# EAGLE design ScreamFilter (EAGLE 6.6.0)
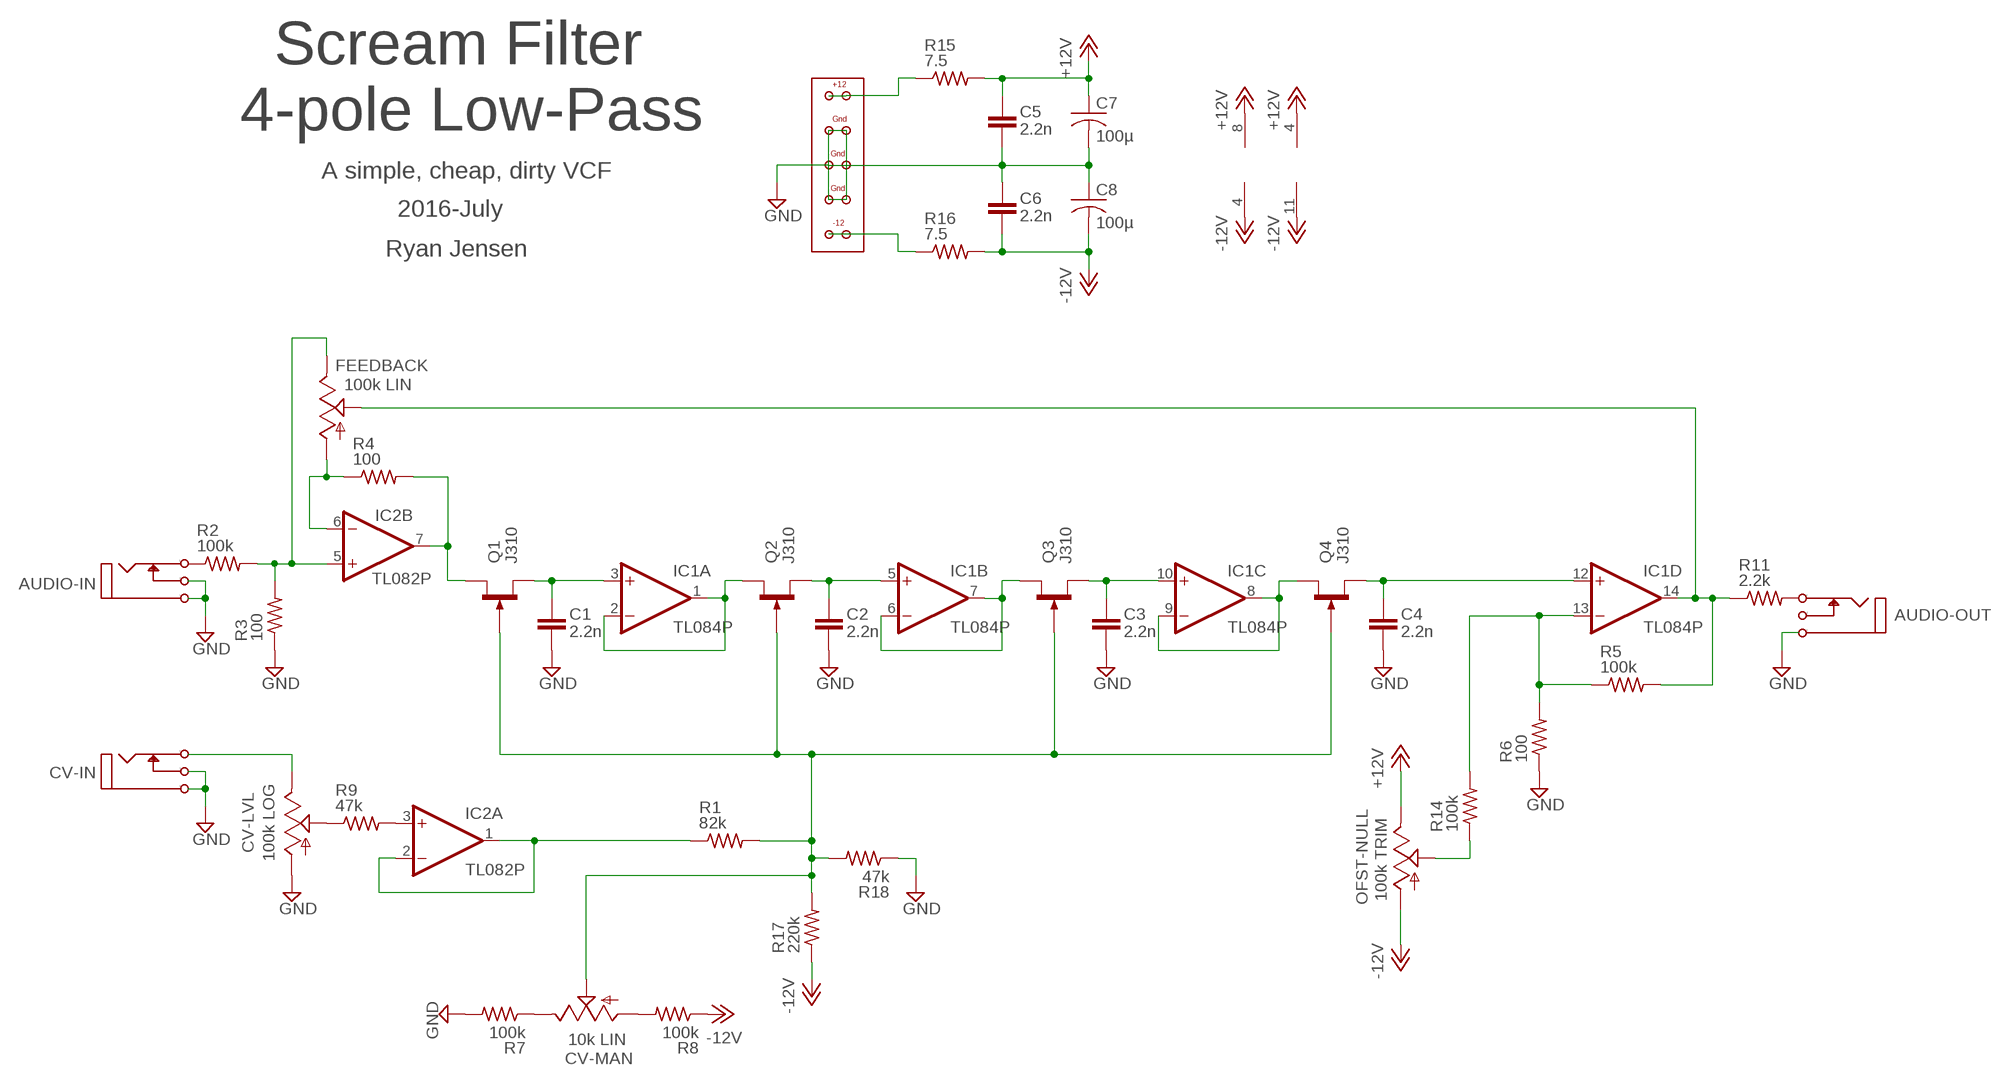
[diagram p0: schematic, sheet 1]

## Parts
AUDIO-IN  I/O  MONO_JACK  [MONO_JACK]
AUDIO-OUT  I/O  MONO_JACK  [MONO_JACK]
C1  2.2n  C-EU025-025X050  [C025-025X050]
C2  2.2n  C-EU025-025X050  [C025-025X050]
C3  2.2n  C-EU025-025X050  [C025-025X050]
C4  2.2n  C-EU025-025X050  [C025-025X050]
C5  2.2n  C-EU025-025X050  [C025-025X050]
C6  2.2n  C-EU025-025X050  [C025-025X050]
C7  100µ  C-US025-050X050  [C025-050X050]
C8  100µ  C-US025-050X050  [C025-050X050]
CV-IN  I/O  MONO_JACK  [MONO_JACK]
CV-LVL  100k LOG  TRIM_US-B64Y  [B64Y]
CV-MAN  10k LIN  TRIM_US-B64Y  [B64Y]
FEEDBACK  100k LIN  TRIM_US-B64Y  [B64Y]
IC1  TL084P  [DIL14]
IC2  TL082P  [DIL08]
OFST-NULL  100k TRIM  TRIM_US-B64Y  [B64Y]
Q1  J310  [TO92R]
Q2  J310  [TO92R]
Q3  J310  [TO92R]
Q4  J310  [TO92R]
R1  82k  R-US_0204/7  [0204/7]
R2  100k  R-US_0204/7  [0204/7]
R3  100  R-US_0204/7  [0204/7]
R4  100  R-US_0204/7  [0204/7]
R5  100k  R-US_0204/7  [0204/7]
R6  100  R-US_0204/7  [0204/7]
R7  100k  R-US_0204/7  [0204/7]
R8  100k  R-US_0204/7  [0204/7]
R9  47k  R-US_0204/7  [0204/7]
R11  2.2k  R-US_0204/7  [0204/7]
R14  100k  R-US_0204/7  [0204/7]
R15  7.5  R-US_0204/7  [0204/7]
R16  7.5  R-US_0204/7  [0204/7]
R17  220k  R-US_0204/7  [0204/7]
R18  47k  R-US_0204/7  [0204/7]
U$1  EURORACK-POWER  [EURORACK-POWER]

## Nets
+12V: C5.1 C7.1 IC1.4(P:V+) IC2.8(P:V+) OFST-NULL.E R15.2
-12V: C6.2 C8.2 IC1.11(P:V-) IC2.4(P:V-) OFST-NULL.A R8.1 R16.2 R17.1
GND: AUDIO-IN.P$1 AUDIO-IN.P$3(P3) AUDIO-OUT.P$1 C1.2 C2.2 C3.2 C4.2 C5.2 C6.1 C7.2 C8.1 CV-IN.P$1 CV-IN.P$3(P3) CV-LVL.A R3.1 R6.1 R7.2 R18.1 U$1.P$3 U$1.P$4 U$1.P$5 U$1.P$6 U$1.P$7 U$1.P$8
N$1: AUDIO-IN.P$2(P2) R2.1
N$2: FEEDBACK.E IC2.5(B:+IN) R2.2 R3.2
N$4: IC2.7(B:OUT) Q1.D R4.2
N$5: C1.1 IC1.3(A:+IN) Q1.S
N$6: IC1.1(A:OUT) IC1.2(A:-IN) Q2.D
N$8: C2.1 IC1.5(B:+IN) Q2.S
N$9: IC1.6(B:-IN) IC1.7(B:OUT) Q3.D
N$10: FEEDBACK.S IC1.14(D:OUT) R5.2 R11.1
N$12: C3.1 IC1.10(C:+IN) Q3.S
N$13: IC1.8(C:OUT) IC1.9(C:-IN) Q4.D
N$16: C4.1 IC1.12(D:+IN) Q4.S
N$17: CV-MAN.E R7.1
N$18: OFST-NULL.S R14.1
N$19: IC1.13(D:-IN) R5.1 R6.2 R14.2
N$20: CV-MAN.A R8.2
N$21: CV-IN.P$2(P2) CV-LVL.E
N$22: IC2.3(A:+IN) R9.2
N$23: CV-MAN.S Q1.G Q2.G Q3.G Q4.G R1.2 R17.2 R18.2
N$24: AUDIO-OUT.P$2(P2) R11.2
N$25: CV-LVL.S R9.1
N$27: FEEDBACK.A IC2.6(B:-IN) R4.1
N$28: R16.1 U$1.P$9 U$1.P$10
N$29: R15.1 U$1.P$1 U$1.P$2
N$30: IC2.1(A:OUT) IC2.2(A:-IN) R1.1
Unconnected: AUDIO-OUT.P$3(P3)

## Notes on the sheet
- Scream Filter
  4-pole Low-Pass
- A simple, cheap, dirty VCF
- 2016-July
- Ryan Jensen

## Library data of the parts
AUDIO-IN AUDIO-OUT CV-IN = !synth_sch:MONO_JACK
C1-C6 = rcl:C-EU: CAPACITOR, European symbol
C7 C8 = rcl:C-US: CAPACITOR, American symbol
CV-LVL CV-MAN FEEDBACK OFST-NULL = pot:TRIM_US-: POTENTIOMETER
IC1 = linear:TL084: OP AMP
IC2 = linear:TL082: OP AMP Data sheet <http://www.ti.com/lit/ds/symlink/tl084a . pdf>; DATA_SHEET: <a href="http://www.ti.com/lit/ds/symlink/tl084a.pdf"> Data sheet </a>
Q1-Q4 = transistor-small-signal:J310: N-Channel RF Amplifier J309, J310 Source: http://www.fairchildsemi.com/pf/J3/J310.html
R1-R9 R11 R14-R18 = rcl:R-US_: RESISTOR, American symbol
U$1 = !synth_sch:EURORACK-POWER

## Board
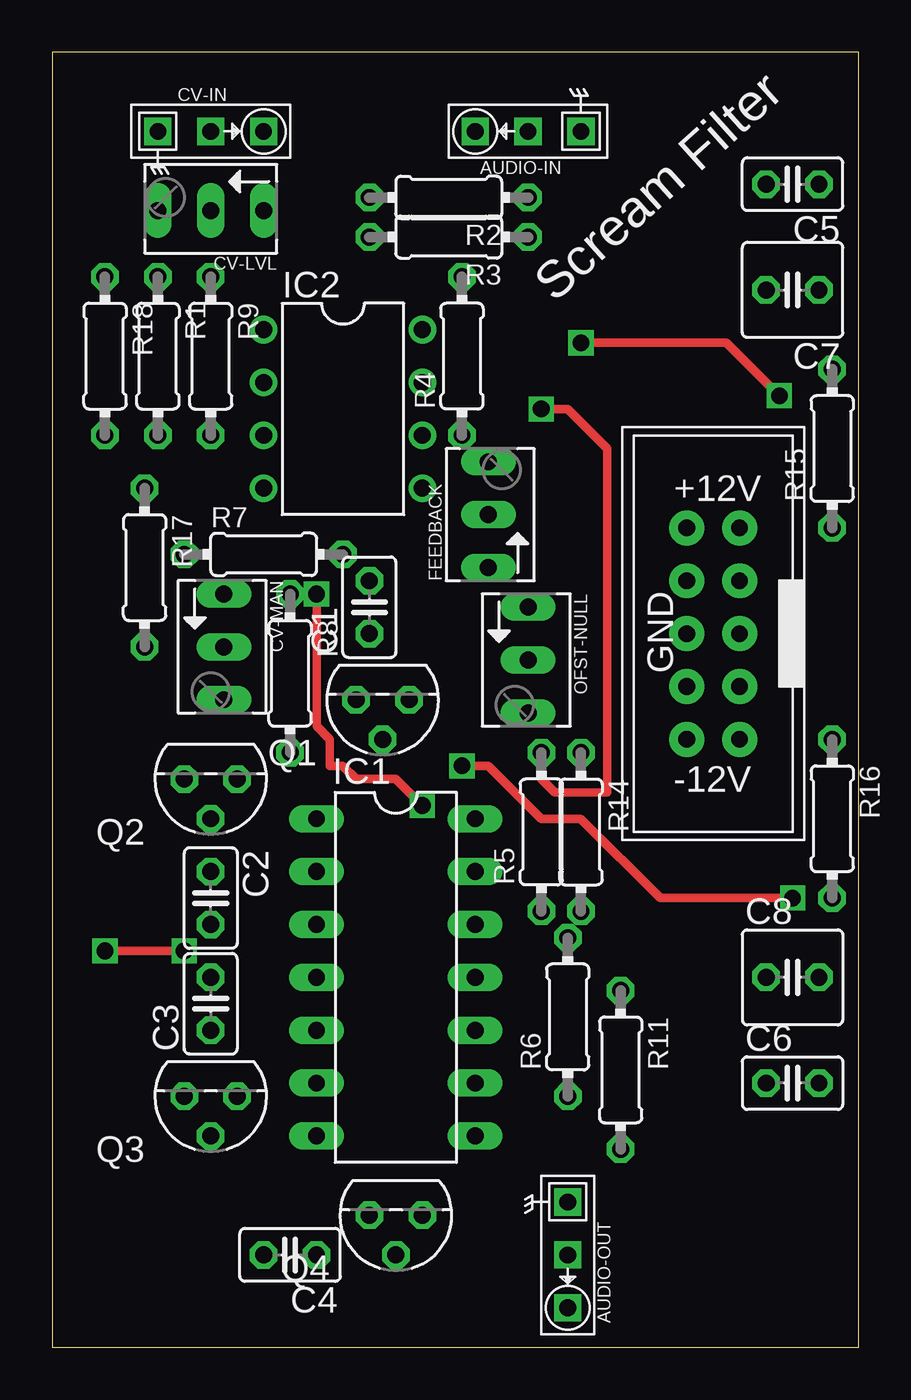
[diagram p1: board, top side]
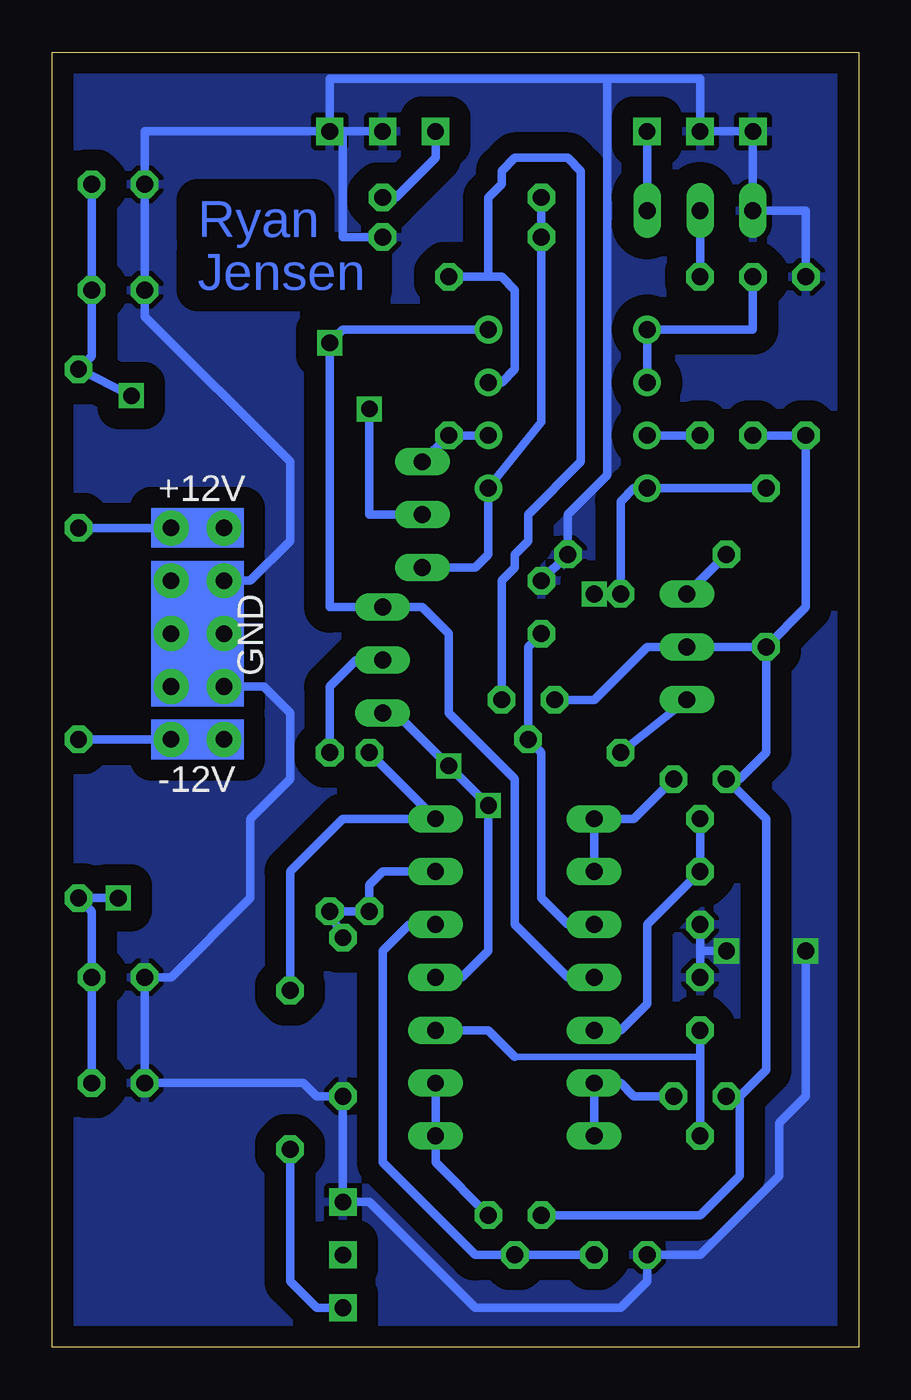
[diagram p2: board, bottom side, seen from below]

Size 38.73 x 62.23 mm. Coordinates in mm from the lower left corner, seen from the top.
Outline: 0,0 38.73,0 38.73,62.23 0,62.23 0,0
Copper layers (1*16): Top 0.035mm / dielectric 1.5mm / Bottom 0.035mm
Design rules "default": minimum track width 10mil, minimum drill 24mil, track to track 8mil, track to pad 8mil, pad to pad 8mil, via to via 8mil, smd to smd 8mil, copper to edge 40mil, drill to drill 8mil, minimum pad ring 10mil, minimum via ring 8mil, stop-mask expansion 4mil, vias tented up to drill 0mil, thermal gap 10mil

### Footprints (pad centres in the part's own frame; a part is rotated, then mirrored left to right if it is on the bottom)
MONO_JACK = drill 0.8 square: P$1 -2.54,0; P$2 2.54,0; P$3 0,0
C025-025X050 = drill 0.813 octagon: 1 -1.27,0; 2 1.27,0
C025-050X050 = drill 0.813 octagon: 1 -1.27,0; 2 1.27,0
B64Y = drill 0.813 long: A 2.54,0; E -2.54,0; S 0,0
DIL14 = drill 0.813 long: 1 -7.62,-3.81; 2 -5.08,-3.81; 3 -2.54,-3.81; 4 0,-3.81; 5 2.54,-3.81; 6 5.08,-3.81; 7 7.62,-3.81; 8 7.62,3.81; 9 5.08,3.81; 10 2.54,3.81; 11 0,3.81; 12 -2.54,3.81; 13 -5.08,3.81; 14 -7.62,3.81
DIL08 = drill 0.813 pad 1.27: 1 -3.81,-3.81; 2 -1.27,-3.81; 3 1.27,-3.81; 4 3.81,-3.81; 5 3.81,3.81; 6 1.27,3.81; 7 -1.27,3.81; 8 -3.81,3.81
TO92R = drill 0.813 octagon: D -1.27,0; G 1.27,0; S 0,1.905
0204/7 = drill 0.813 octagon: 1 -3.81,0; 2 3.81,0
EURORACK-POWER = drill 0.8 pad 1.676: P$1 -1.27,5.08; P$2 1.27,5.08; P$3 -1.27,2.54; P$4 1.27,2.54; P$5 -1.27,0; P$6 1.27,0; P$7 -1.27,-2.54; P$8 1.27,-2.54; P$9 -1.27,-5.08; P$10 1.27,-5.08

### Placement (x,y rotation side)
AUDIO-IN  22.86,58.42 180 top
AUDIO-OUT  24.77,4.45 270 top
C1  15.24,35.56 90 top
C2  7.62,21.59 270 top
C3  7.62,16.51 90 top
C4  11.43,4.45 180 top
C5  35.56,55.88 180 top
C6  35.56,12.7 0 top
C7  35.56,50.8 180 top
C8  35.56,17.78 0 top
CV-IN  7.62,58.42 0 top
CV-LVL  7.62,54.61 180 top
CV-MAN  8.26,33.66 270 top
FEEDBACK  20.95,40.01 90 top
IC1  16.51,17.78 270 top
IC2  13.97,45.09 270 top
OFST-NULL  22.86,33.02 270 top
Q1  15.88,31.11 180 top
Q2  7.62,27.3 180 top
Q3  7.62,12.06 180 top
Q4  16.51,6.35 180 top
R1  5.08,47.62 270 top
R2  19.05,55.24 180 top
R3  19.05,53.34 180 top
R4  1k  [0204/7]  19.68,47.62 90 top
R5  23.5,24.77 90 top
R6  24.77,15.88 90 top
R7  10.16,38.1 0 top
R8  11.43,32.38 270 top
R9  7.62,47.62 270 top
R11  27.3,13.34 270 top
R14  25.4,24.77 270 top
R15  37.47,43.18 90 top
R16  37.47,25.4 270 top
R17  4.45,37.47 270 top
R18  2.54,47.62 270 top
U$1  31.75,34.29 0 top

### Tracks (layer width: path | path; a pad name or v marks a point on that pad's centre or on a via)
+12V  (via drill 0.8)
  Top 0.406: v25.4,48.26 32.38,48.26 v34.92,45.72
  Bottom 0.406: C5.1 C7.1 36.83,47.62 R15.2 v34.92,45.72 | IC2.8 24.77,48.9 v25.4,48.26 25.4,35.56 OFST-NULL.E 20.95,35.56 19.68,34.29 19.68,30.48 16.51,27.3 16.51,20.32 13.97,17.78 IC1.4
-12V  (via drill 0.8)
  Top 0.406: v19.68,27.94 20.95,27.94 23.5,25.4 25.4,25.4 29.21,21.59 v35.56,21.59 | v12.7,36.2 12.7,29.84 13.34,29.21 13.34,27.94 13.97,27.94 14.61,27.3 16.51,27.3 v17.78,26.04
  Bottom 0.406: R17.1 IC2.4 10.79,41.27 11.43,40.64 R8.1 v12.7,36.2 | C6.2 C8.2 36.83,20.95 R16.2 v35.56,21.59 | IC1.11 19.05,17.78 17.78,19.05 v17.78,26.04 v19.68,27.94 22.23,30.48 OFST-NULL.A
GND  (via drill 0.8)
  Top 0.406: v6.35,19.05 v2.54,19.05
  Bottom 0.406: AUDIO-IN.P$3 AUDIO-IN.P$1 | R18.1 2.54,54.61 CV-LVL.A CV-IN.P$1 CV-IN.P$3 7.62,60.96 12.06,60.96 | 12.06,60.96 12.06,41.91 13.97,40.01 R7.2 C1.2 | 7.62,19.05 C2.2 | AUDIO-IN.P$1 34.29,58.42 C5.2 C7.2 34.29,49.53 27.3,42.55 27.3,38.73 29.21,36.83 U$1.P$3 U$1.P$4 U$1.P$6 | U$1.P$5 U$1.P$6 | U$1.P$6 U$1.P$8 U$1.P$7 28.57,31.75 27.3,30.48 27.3,27.3 29.21,25.4 29.21,21.59 33.02,17.78 C8.1 C6.1 26.67,12.7 26.04,12.06 R6.1 AUDIO-OUT.P$1 23.5,6.99 18.41,1.91 11.43,1.91 10.16,3.17 C4.2 7.62,4.45 3.81,8.26 3.81,10.79 2.54,12.06 v2.54,19.05 | C3.2 7.62,19.05 | 7.62,19.05 v6.35,19.05 | AUDIO-IN.P$1 24.77,58.42 24.77,53.34 R3.1 | 12.06,60.96 25.4,60.96 AUDIO-IN.P$1
  pour Bottom (isolate 1.016): 0,62.23 0,0 38.1,0 38.73,0 38.73,62.23
N$1
  Bottom 0.406: R2.1 22.23,55.24 20.32,57.15 AUDIO-IN.P$2
N$2
  Bottom 0.406: R2.2 R3.2 15.24,44.45 IC2.5 17.78,38.1 18.41,37.47 FEEDBACK.E
N$4
  Bottom 0.406: R4.2 17.78,51.44 | 17.78,51.44 17.14,51.44 16.51,50.8 16.51,46.99 17.14,46.35 IC2.7 | Q1.D 17.14,36.83 16.51,37.47 16.51,38.1 15.88,38.73 15.88,40.01 13.34,42.55 13.34,56.52 13.97,57.15 16.51,57.15 17.14,56.52 17.14,55.88 17.78,55.24 17.78,51.44
N$5
  Bottom 0.406: C1.1 15.88,33.66 Q1.S 15.24,28.57 15.24,21.59 13.97,20.32 IC1.3
N$6
  Bottom 0.406: IC1.2 IC1.1 10.79,25.4 Q2.D
N$8
  Bottom 0.406: Q2.S C2.1 10.16,20.32 10.16,16.51 11.43,15.24 IC1.5
N$9
  Bottom 0.406: IC1.7 IC1.6 11.43,12.7 10.79,12.06 Q3.D
N$10  (via drill 0.8)
  Top 0.406: v23.5,45.09 24.77,45.09 26.67,43.18 26.67,26.67 24.13,26.67 23.5,27.3 R5.2
  Bottom 0.406: R5.2 IC1.14 24.77,25.4 27.3,22.86 R11.1 | FEEDBACK.S 23.5,40.01 v23.5,45.09
N$12
  Bottom 0.305: 16.51,13.97 7.62,13.97
  Bottom 0.406: Q3.S 7.62,13.97 C3.1 | IC1.10 17.78,15.24 16.51,13.97
N$13
  Bottom 0.406: IC1.9 IC1.8 20.32,8.89 Q4.D
N$16
  Bottom 0.406: IC1.12 21.59,20.32 22.86,19.05 22.86,8.89 18.41,4.45 Q4.S C4.1
N$17
  Bottom 0.406: R7.1 CV-MAN.E
N$18
  Bottom 0.406: OFST-NULL.S 24.13,33.02 25.4,31.75 R14.1
N$19
  Bottom 0.406: IC1.13 22.86,22.86 23.5,22.23 R5.1 R14.2 R6.2
N$20
  Bottom 0.406: CV-MAN.A R8.2
N$21
  Bottom 0.406: CV-LVL.E CV-IN.P$2
N$22
  Bottom 0.406: R9.2 IC2.3
N$23
  Bottom 0.406: R1.2 R18.2 2.54,35.56 R17.2 | R17.2 CV-MAN.S 10.16,33.66 12.7,31.11 Q1.G | R17.2 4.45,28.57 5.71,27.3 Q2.G 4.45,25.4 4.45,13.34 5.71,12.06 | Q3.G 5.71,12.06 | Q4.G 7.62,6.35 5.71,8.26 5.71,12.06
N$24
  Bottom 0.406: AUDIO-OUT.P$2 26.04,1.91 27.3,3.17 R11.2
N$25
  Bottom 0.406: R9.1 CV-LVL.S
N$27
  Bottom 0.406: IC2.6 R4.1 FEEDBACK.A
N$28
  Bottom 0.406: R16.1 U$1.P$10 U$1.P$9
N$29
  Bottom 0.406: R15.1 U$1.P$2 U$1.P$1
N$30
  Bottom 0.406: R1.1 5.08,48.9 IC2.1 IC2.2

### Text on the board
Bottom: Ryan | Jensen
tNames: Scream Filter